# EAGLE schematic ts-7553-v2-xbee-door-alarm-simple (EAGLE 8.3.2)
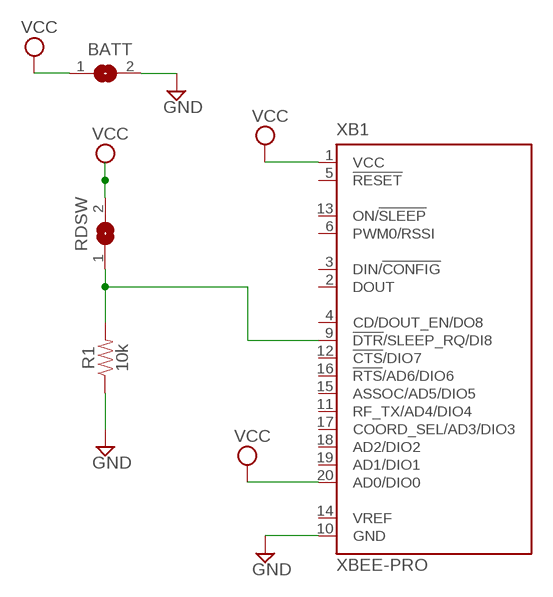
[diagram p0: schematic, sheet 1]

## Parts
BATT  SJW  [SJW]
R1  10k  10KOHM-HORIZ-1/4W-5%  [AXIAL-0.3]
RDSW  SJW  [SJW]
XB1  XBEE-PRO  [XBEE-PRO]

## Nets
GND: BATT.2 R1.P$1 XB1.10(GND)
SLEEP: R1.P$2 RDSW.1 XB1.9(!DTR!/SLEEP_RQ/DI8)
VCC: BATT.1 RDSW.2 XB1.1(VCC) XB1.20(AD0/DIO0)
Unconnected: XB1.2(DOUT) XB1.3(DIN/!CONFIG) XB1.4(CD/DOUT_EN/DO8) XB1.5(!RESET) XB1.6(PWM0/RSSI) XB1.11(RF_TX/AD4/DIO4) XB1.12(!CTS!/DIO7) XB1.13(ON/!SLEEP) XB1.14(VREF) XB1.15(ASSOC/AD5/DIO5) XB1.16(!RTS!/AD6/DIO6) XB1.17(COORD_SEL/AD3/DIO3) XB1.18(AD2/DIO2) XB1.19(AD1/DIO1)

## Library data of the parts
BATT RDSW = jumper:SJ: SMD solder JUMPER
R1 = SparkFun-Resistors:10KOHM: 10kΩ resistor A resistor is a passive two-terminal electrical component that implements electrical resistance as a circuit element. Resistors act to reduce current flow, and, at the same time, act to lower voltage levels within circuits. - Wikipedia; PROD_ID: RES-09435
XB1 = maxstream:XBEE: XBee (TM) /XBee-PRO(TM) OEM RF Modules Source: MaxStream, Inc. xbee_productmanual.pdf; MPN: XBP24-AWI-001; OC_FARNELL: 1337916; OC_NEWARK: 42M2667

## Net classes
0 default: width 0.203 mm